# EAGLE design Temperature (EAGLE 9.6.2)
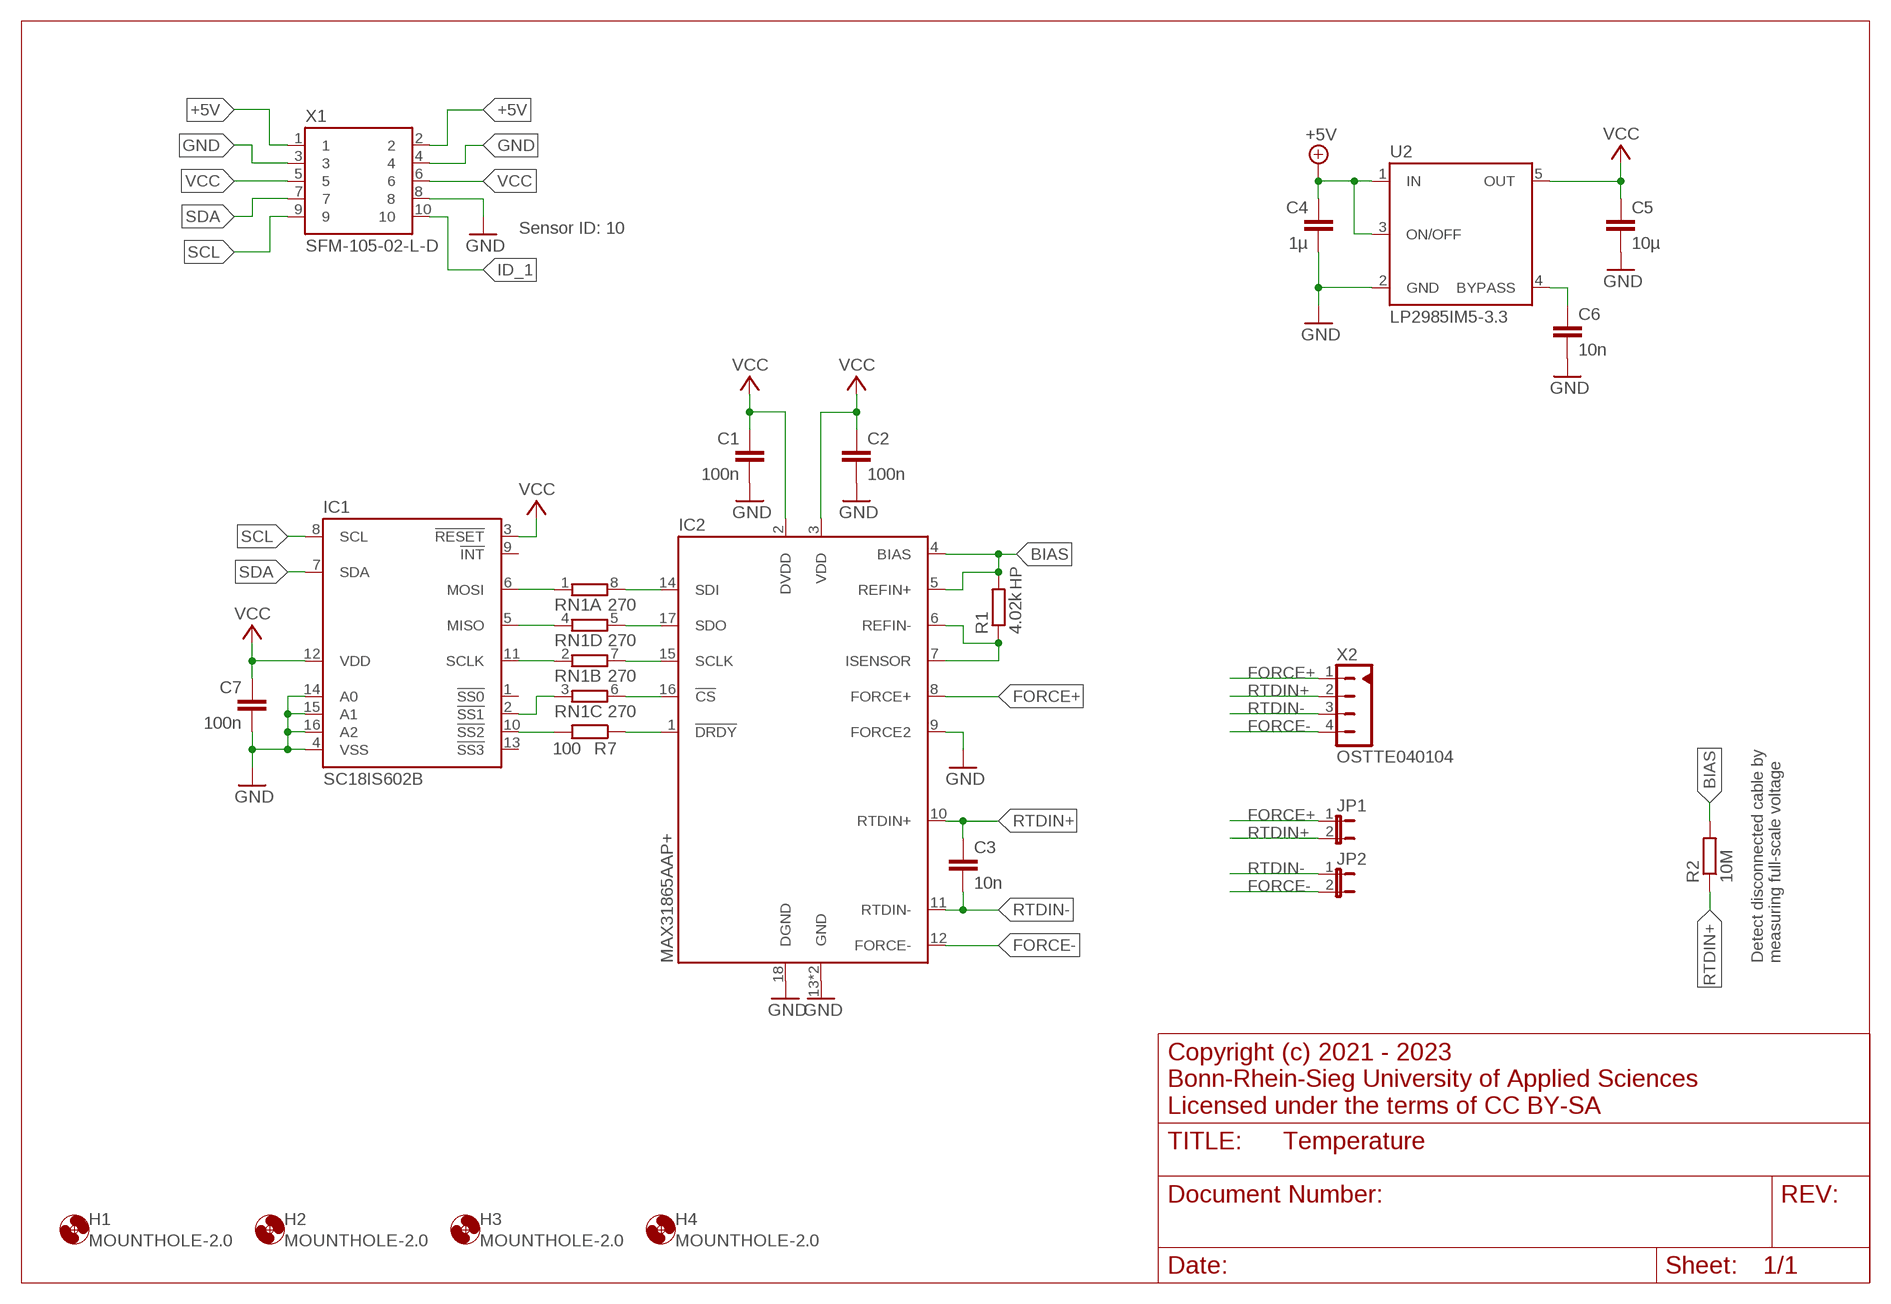
[diagram p0: schematic, sheet 1]

## Parts
C1  100n  C-EUC0603  [C0603]
C2  100n  C-EUC0603  [C0603]
C3  10n  C-EUC0603  [C0603]
C4  1µ  C-EUC0603  [C0603]
C5  10µ  C-EUC0603  [C0603]
C6  10n  C-EUC0603  [C0603]
C7  100n  C-EUC0603  [C0603]
H1  MOUNTHOLE-2.0  [2.0]
H2  MOUNTHOLE-2.0  [2.0]
H3  MOUNTHOLE-2.0  [2.0]
H4  MOUNTHOLE-2.0  [2.0]
IC1  SC18IS602B  [TSSOP16]
IC2  MAX31865AAP+  [SSOP20]
JP1  JP1E  [JP1]
JP2  JP1E  [JP1]
R1  4.02k  R-EU_R0603  [R0603]
R2  10M  R-EU_R0603  [R0603]
R7  100  R-EU_R0603  [R0603]
RN1  270  4R-NEXB38V  [EXB38V]
U2  LP2985IM5-3.3  [SOT23-5]
X1  SFM-105-02-L-D  [SAMTEC-SFM-105-02-L-D]
X2  OSTTE040104  [OSTTE04]

## Nets
+5V: C4.1 U2.1(IN) U2.3(ON/OFF) X1.1 X1.2
BIAS: IC2.4(BIAS) IC2.5(REFIN+) R1.2 R2.2
FORCE+: IC2.8(FORCE+) JP1.1 X2.1
FORCE-: IC2.12(FORCE-) JP2.2 X2.4
GND: C1.2 C2.2 C4.2 C5.2 C6.2 C7.2 IC1.4(VSS) IC1.14(A0) IC1.15(A1) IC1.16(A2) IC2.9(FORCE2) IC2.13(GND) IC2.18(DGND) IC2.19(GND) U2.2(GND) X1.3 X1.4 X1.8
ID_1: X1.10
N$1: IC1.10(!SS2) R7.2
N$2: IC2.16(!CS) RN1.6
N$3: IC2.15(SCLK) RN1.7
N$4: IC2.6(REFIN-) IC2.7(ISENSOR) R1.1
N$5: IC2.17(SDO) RN1.5
N$6: IC2.14(SDI) RN1.8
N$7: IC1.6(MOSI) RN1.1
N$8: C6.1 U2.4(BYPASS)
N$9: IC1.5(MISO) RN1.4
N$10: IC1.11(SCLK) RN1.2
N$11: IC1.2(!SS1) RN1.3
N$12: IC2.1(!DRDY) R7.1
RTDIN+: C3.1 IC2.10(RTDIN+) JP1.2 R2.1 X2.2
RTDIN-: C3.2 IC2.11(RTDIN-) JP2.1 X2.3
SCL: IC1.8(SCL) X1.9
SDA: IC1.7(SDA) X1.7
VCC: C1.1 C2.1 C5.1 C7.1 IC1.3(!RESET) IC1.12(VDD) IC2.2(DVDD) IC2.3(VDD) U2.5(OUT) X1.5 X1.6
Unconnected: IC1.1(!SS0) IC1.9(!INT) IC1.13(!SS3)

## Notes on the sheet
- Sensor ID: 10
- Detect disconnected cable by
  measuring full-scale voltage
- Copyright (c) 2021 - 2023
  Bonn-Rhein-Sieg University of Applied Sciences
  Licensed under the terms of CC BY-SA

## Library data of the parts
C1-C7 = rcl:C-EU: CAPACITOR, European symbol; SPICEPREFIX: C
H1-H4 = MountHoles:MOUNTHOLE-2.0
IC1 = SC18IS602B:SC18IS602B: I2C-bus to SPI bridge
IC2 = MAX31865:MAX31865A?P+: RTD-to-Digital Converter
JP1 JP2 = jumper:JP1E: JUMPER
R1 = rcl:R-EU_: RESISTOR, European symbol; HP: 1; SPICEPREFIX: R
R2 R7 = rcl:R-EU_: RESISTOR, European symbol; SPICEPREFIX: R
RN1 = resistor-dil:4R-N: Array Chip Resistor Source: RS Component / Phycomp; OC_FARNELL: unknown; OC_NEWARK: unknown
U2 = LP2985:LP2985?-*: LP2985-N Micropower 150-mA Low-Noise Ultra-Low-Dropout Regulator in a SOT-23 Package Designed for Use With Very Low ESR Output Capacitors
X1 = SFM-10x-02-L-D:SFM-105-02-L-D
X2 = OSTTE:OSTTE04

## Board
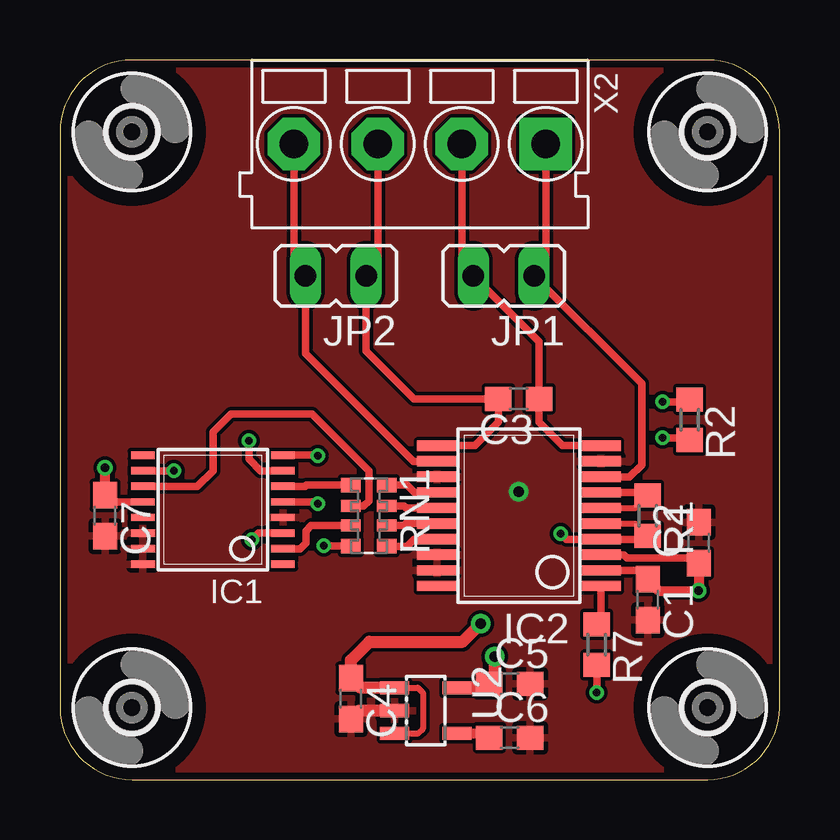
[diagram p1: board, top side]
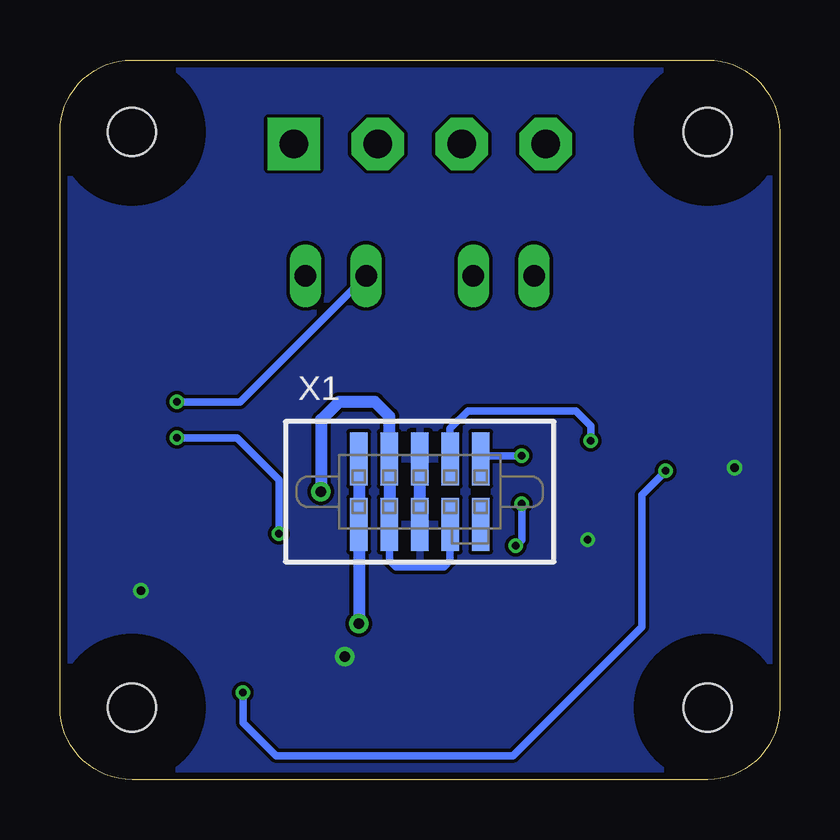
[diagram p2: board, bottom side, seen from below]

Size 30 x 30 mm. Coordinates in mm from the lower left corner, seen from the top.
Outline: 3,0 27,0 arc90 30,3 30,27 arc90 27,30 3,30 arc90 0,27 0,3 arc90 3,0
Copper layers (1*16): Top 0.035mm / dielectric 1.5mm / Bottom 0.035mm
Design rules "PCB-POOL Standard": minimum track width 0.15mm, minimum drill 0.3mm, track to track 0.15mm, track to pad 0.15mm, pad to pad 0.15mm, via to via 0.15mm, smd to smd 0.15mm, copper to edge 0.3mm, drill to drill 0.2mm, minimum pad ring 0.2mm, minimum via ring 0.15mm, stop-mask expansion 0.075mm, vias tented up to drill 0mil, thermal gap 0.2mm

### Footprints (pad centres in the part's own frame; a part is rotated, then mirrored left to right if it is on the bottom)
C0603 = smd 1.1 x 1: 1 -0.85,0; 2 0.85,0
2.0 = hole 2: 0,0
TSSOP16 = smd 0.305 x 0.991: 1 -2.275,-2.918; 2 -1.625,-2.918; 3 -0.975,-2.918; 4 -0.325,-2.918; 5 0.325,-2.918; 6 0.975,-2.918; 7 1.625,-2.918; 8 2.275,-2.918; 9 2.275,2.918; 10 1.625,2.918; 11 0.975,2.918; 12 0.325,2.918; 13 -0.325,2.918; 14 -0.975,2.918; 15 -1.625,2.918; 16 -2.275,2.918
SSOP20 = smd 0.43 x 1.63: 1 -2.925,-3.425; 2 -2.275,-3.425; 3 -1.625,-3.425; 4 -0.975,-3.425; 5 -0.325,-3.425; 6 0.325,-3.425; 7 0.975,-3.425; 8 1.625,-3.425; 9 2.275,-3.425; 10 2.925,-3.425; 11 2.925,3.425; 12 2.275,3.425; 13 1.625,3.425; 14 0.975,3.425; 15 0.325,3.425; 16 -0.325,3.425; 17 -0.975,3.425; 18 -1.625,3.425; 19 -2.275,3.425; 20 -2.925,3.425
JP1 = drill 0.914 long: 1 0,-1.27; 2 0,1.27
R0603 = smd 1 x 1.1: 1 -0.85,0; 2 0.85,0
EXB38V = smd 0.6 x 0.8: 1 -1.275,-0.75; 4 1.275,-0.75; 5 1.275,0.75; 8 -1.275,0.75 | smd 0.5 x 0.8: 2 -0.4,-0.75; 3 0.4,-0.75; 6 0.4,0.75; 7 -0.4,0.75
SOT23-5 = smd 0.55 x 1.2: 1 -0.95,-1.3; 2 0,-1.3; 3 0.95,-1.3; 4 0.95,1.3; 5 -0.95,1.3
SAMTEC-SFM-105-02-L-D = smd 0.74 x 2.22: 1 -2.54,1.365; 2 -2.54,-1.365; 3 -1.27,1.365; 4 -1.27,-1.365; 5 0,1.365; 6 0,-1.365; 7 1.27,1.365; 8 1.27,-1.365; 9 2.54,1.365; 10 2.54,-1.365
OSTTE04 = drill 1.168 pad 2.184 square: 1 -5.25,0 | drill 1.168 pad 2.184 octagon: 2 -1.75,0; 3 1.75,0; 4 5.25,0

### Placement (x,y rotation side)
C1  24.5,7.5 270 top
C2  26.62,9.88 90 top
C3  19.12,15.88 180 top
C4  12.12,3.38 270 top
C5  18.75,4 0 top
C6  18.75,1.75 0 top
C7  1.88,11 270 top
H1  3,3 0 top
H2  27,3 0 top
H3  27,27 0 top
H4  3,27 0 top
IC1  6.38,11.25 90 top
IC2  19.14,10.99 90 top
JP1  18.5,21 90 top
JP2  11.5,21 90 top
R1  24.5,11 270 top
R2  26.25,15 270 top
R7  22.38,5.62 270 top
RN1  12.88,11 270 top
U2  15.25,2.88 270 top
X1  15,12 0 bottom
X2  15,26.5 180 top

### Tracks (layer width: path | path; a pad name or v marks a point on that pad's centre or on a via)
+5V  (via drill 0.45)
  Top 0.254: U2.3 14.93,1.93 15.12,2.12 15.12,3.62 14.93,3.83 U2.1
  Top 0.508: U2.1 12.53,3.83 C4.1 12.12,4.97 12.9,5.75 16.79,5.75 v17.54,6.5
  Bottom 0.508: X1.1 X1.2 v17.54,6.5
BIAS  (via drill 0.3)
  Top 0.254: IC2.5 23.98,10.67 R1.2
  Top 0.305: R1.2 24.37,10.02 IC2.4 21.11,10.02 v20.88,10.25 | R2.2 26.15,14.25 v25.12,14.25
  Bottom 0.305: v25.12,14.25 22.62,14.25 20.88,12.5 v20.88,10.25
FORCE+
  Top 0.305: IC2.8 23.75,12.62 24.25,13.12 24.25,16.52 JP1.1 20.25,21.48 X2.1
FORCE-
  Top 0.305: IC2.12 14.73,13.27 10.23,17.77 JP2.2 9.75,21.48 X2.4
GND  (via drill 0.45)
  Top 0.508: U2.2 12.47,2.88 C4.2
  Bottom 0.305: X1.8 13.73,9.14 14,8.88 16,8.88 16.27,9.14 X1.4
  Bottom 0.508: X1.4 X1.3 16.27,15.14 16.88,15.75 18.38,15.75 19.12,15 v19.12,12
  pour Top: 3,0 27,0 arc90 30,3 30,27 arc90 27,30 3,30 arc90 0,27 0,3 arc90
N$1  (via drill 0.3)
  Top 0.305: v4.75,12.88 IC1.10 | v22.38,3.62 R7.2
  Bottom 0.305: v4.75,12.88 5.75,11.88 5.75,6.38 11.12,1 21,1 22.38,2.38 v22.38,3.62
N$2
  Top 0.305: IC2.16 14.42,10.67 14.35,10.6 RN1.6
N$3
  Top 0.305: IC2.15 14.43,11.32 14.35,11.4 RN1.7
N$4
  Top 0.254: IC2.6 23.97,11.32 R1.1
  Top 0.305: IC2.7 24.38,11.97 R1.1
N$5
  Top 0.305: IC2.17 14.77,10.02 14.47,9.72 RN1.5
N$6
  Top 0.305: IC2.14 14.78,11.97 14.47,12.28 RN1.8
N$7
  Top 0.305: IC1.6 10.22,12.22 10.28,12.28 RN1.1
N$8
  Top 0.406: U2.4 17.73,1.93 C6.1
N$9  (via drill 0.3)
  Top 0.305: IC1.5 10.68,11.57 v10.75,11.5 | v11,9.75 12.1,9.75 RN1.4
  Bottom 0.305: v10.75,11.5 10.75,10 v11,9.75
N$10
  Top 0.305: RN1.2 12.65,11.4 12.88,11.62 12.88,12.88 10.5,15.25 7.12,15.25 6.38,14.5 6.38,12.88 5.72,12.22 IC1.11
N$11
  Top 0.305: IC1.2 10,9.62 10.25,9.88 10.25,10.38 10.47,10.6 RN1.3
N$12
  Top 0.305: IC2.1 22.56,6.66 R7.1
RTDIN+  (via drill 0.3)
  Top 0.305: IC2.10 20.95,13.92 19.98,14.9 C3.1 19.98,18.25 JP1.2 16.75,21.48 X2.2 | v25.12,15.75 26.15,15.75 R2.1
  Bottom 0.305: JP1.2 22.48,15.75 v25.12,15.75
RTDIN-
  Top 0.305: IC2.11 17.3,13.92 18.27,14.9 C3.2 14.75,15.88 12.77,17.86 JP2.1 13.25,21.48 X2.3
SCL  (via drill 0.3)
  Top 0.305: IC1.8 10.72,13.53 v10.75,13.5
  Bottom 0.305: X1.9 12.32,13.5 v10.75,13.5
SDA  (via drill 0.3)
  Top 0.305: IC1.7 8.37,12.88 7.88,13.37 v7.88,14.12
  Bottom 0.305: X1.7 13.73,14.64 13,15.38 8.5,15.38 7.88,14.75 v7.88,14.12
VCC  (via drill 0.3, 0.35, 0.45)
  Top 0.305: IC2.3 23.5,9.37 23.62,9.25 26.4,9.25 C2.1 | IC2.2 24.13,8.72 C1.1 | IC1.12 2.15,11.57 C7.1 | IC1.3 8.28,10.28 v8,10
  Top 0.406: C2.1 v26.62,7.88 24.98,7.88 C1.1 | 17.73,3.83 C5.1 18.12,4.22 | C7.1 v1.88,13
  Top 0.508: U2.5 17.73,3.83 | 18.12,4.22 v18.12,5.12
  Bottom 0.508: X1.6 X1.5
  pour Bottom: 3,0 27,0 arc90 30,3 30,27 arc90 27,30 3,30 arc90 0,27 0,3 arc90

### Text on the board
tStop: 1.1 | Temperature